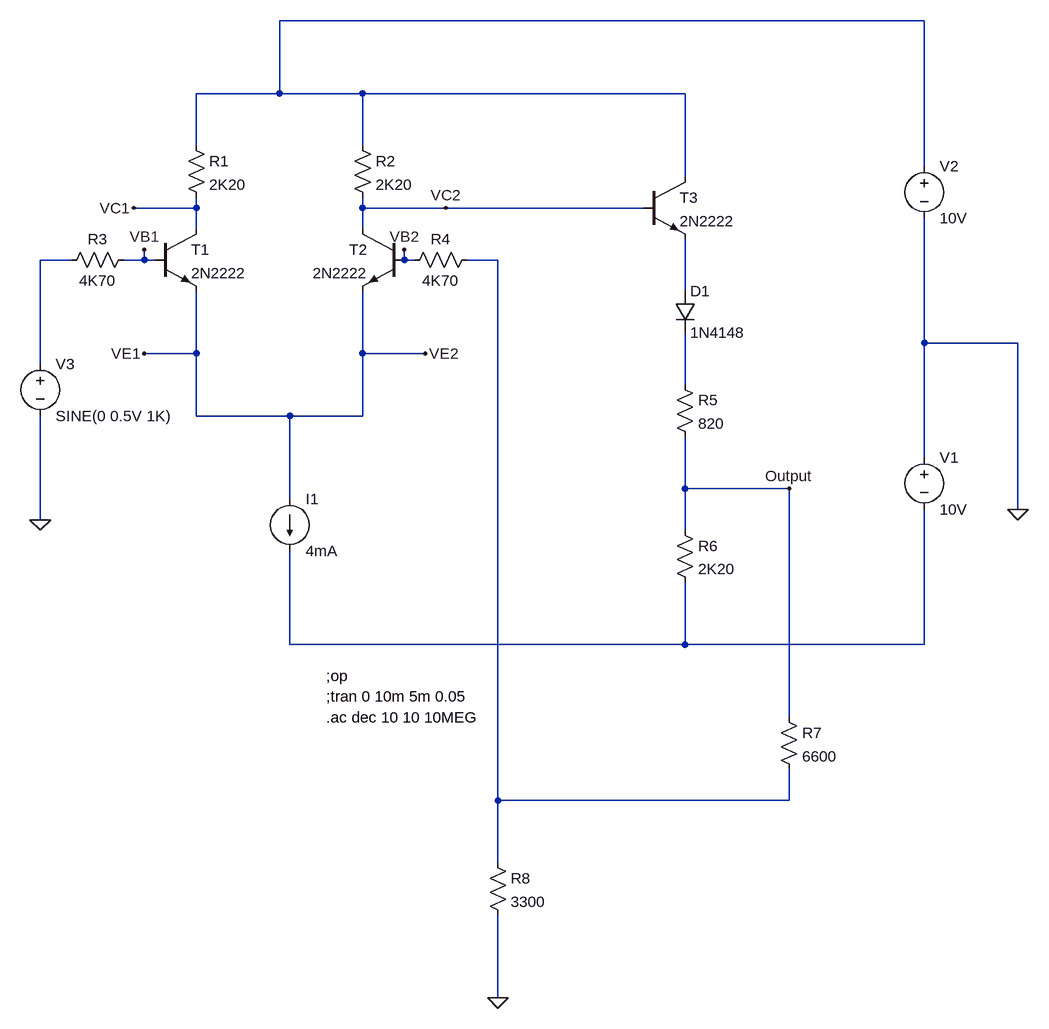
[diagram p0: schematic op_amp_w_feedback.asc]
op_amp_w_feedback.asc, the LTspice schematic file:
Version 4
SHEET 1 1188 1348
WIRE 1024 -176 32 -176
WIRE 32 -64 32 -176
WIRE 32 -64 -96 -64
WIRE 160 -64 32 -64
WIRE 656 -64 160 -64
WIRE -96 16 -96 -64
WIRE 160 16 160 -64
WIRE 1024 48 1024 -176
WIRE 656 64 656 -64
WIRE -96 112 -96 96
WIRE -96 112 -192 112
WIRE 160 112 160 96
WIRE 288 112 160 112
WIRE 592 112 288 112
WIRE -96 144 -96 112
WIRE 160 144 160 112
WIRE -288 192 -336 192
WIRE -176 192 -176 176
WIRE -176 192 -208 192
WIRE -160 192 -176 192
WIRE 224 192 224 176
WIRE 240 192 224 192
WIRE 368 192 320 192
WIRE 656 240 656 160
WIRE 1024 320 1024 128
WIRE 1168 320 1024 320
WIRE -96 336 -96 240
WIRE -96 336 -176 336
WIRE 160 336 160 240
WIRE 256 336 160 336
WIRE -336 352 -336 192
WIRE 656 384 656 304
WIRE -96 432 -96 336
WIRE 48 432 -96 432
WIRE 160 432 160 336
WIRE 160 432 48 432
WIRE 1024 496 1024 320
WIRE 656 544 656 464
WIRE 816 544 656 544
WIRE 48 560 48 432
WIRE 1168 576 1168 320
WIRE -336 592 -336 432
WIRE 656 608 656 544
WIRE 48 784 48 640
WIRE 656 784 656 688
WIRE 656 784 48 784
WIRE 1024 784 1024 576
WIRE 1024 784 656 784
WIRE 816 896 816 544
WIRE 368 1024 368 192
WIRE 816 1024 816 976
WIRE 816 1024 368 1024
WIRE 368 1120 368 1024
WIRE 368 1328 368 1200
FLAG 1168 576 0
FLAG -192 112 VC1
FLAG 288 112 VC2
FLAG -176 336 VE1
FLAG -176 176 VB1
FLAG 224 176 VB2
FLAG 256 336 VE2
FLAG 816 544 Output
FLAG 368 1328 0
FLAG -336 592 0
SYMBOL npn -160 144 R0
SYMATTR InstName T1
SYMATTR Value 2N2222
SYMBOL npn 224 144 M0
SYMATTR InstName T2
SYMATTR Value 2N2222
SYMBOL res -112 0 R0
SYMATTR InstName R1
SYMATTR Value 2K20
SYMBOL res 144 0 R0
SYMATTR InstName R2
SYMATTR Value 2K20
SYMBOL res -192 176 R90
WINDOW 0 0 56 VBottom 2
WINDOW 3 32 56 VTop 2
SYMATTR InstName R3
SYMATTR Value 4K70
SYMBOL res 336 176 R90
WINDOW 0 0 56 VBottom 2
WINDOW 3 32 56 VTop 2
SYMATTR InstName R4
SYMATTR Value 4K70
SYMBOL voltage 1024 480 R0
SYMATTR InstName V1
SYMATTR Value 10V
SYMBOL voltage 1024 32 R0
SYMATTR InstName V2
SYMATTR Value 10V
SYMBOL voltage -336 336 R0
WINDOW 123 0 0 Left 0
WINDOW 39 0 0 Left 0
SYMATTR InstName V3
SYMATTR Value SINE(0 0.5V 1K)
SYMBOL npn 592 64 R0
SYMATTR InstName T3
SYMATTR Value 2N2222
SYMBOL diode 640 240 R0
SYMATTR InstName D1
SYMATTR Value 1N4148
SYMBOL res 640 368 R0
SYMATTR InstName R5
SYMATTR Value 820
SYMBOL res 640 592 R0
SYMATTR InstName R6
SYMATTR Value 2K20
SYMBOL current 48 560 R0
WINDOW 123 0 0 Left 0
WINDOW 39 0 0 Left 0
SYMATTR InstName I1
SYMATTR Value 4mA
SYMBOL res 800 880 R0
SYMATTR InstName R7
SYMATTR Value 6600
SYMBOL res 352 1104 R0
SYMATTR InstName R8
SYMATTR Value 3300
TEXT 104 832 Left 2 !;op
TEXT 104 864 Left 2 !;tran 0 10m 5m 0.05
TEXT 104 896 Left 2 !.ac dec 10 10 10MEG

The netlist it stands for:
* op_amp_w_feedback.asc
Q§T1 VC1 VB1 VE2 0 2N2222
Q§T2 VC2 VB2 VE2 0 2N2222
R1 N001 VC1 2K20
R2 N001 VC2 2K20
R3 VB1 N002 4K70
R4 N003 VB2 4K70
V1 0 N006 10V
V2 N001 0 10V
V3 N002 0 SINE(0 0.5V 1K)
Q§T3 N001 VC2 N004 0 2N2222
D1 N004 N005 1N4148
R5 N005 Output 820
R6 Output N006 2K20
I1 VE2 N006 4mA
R7 Output N003 6600
R8 N003 0 3300
.model D D
.lib standard.dio
.model NPN NPN
.model PNP PNP
.lib standard.bjt
;op
;tran 0 10m 5m 0.05
.ac dec 10 10 10MEG
.backanno
.end